# EAGLE design NSL_CylonIII_backside (EAGLE 5.10)

## Sheet 1 of 3
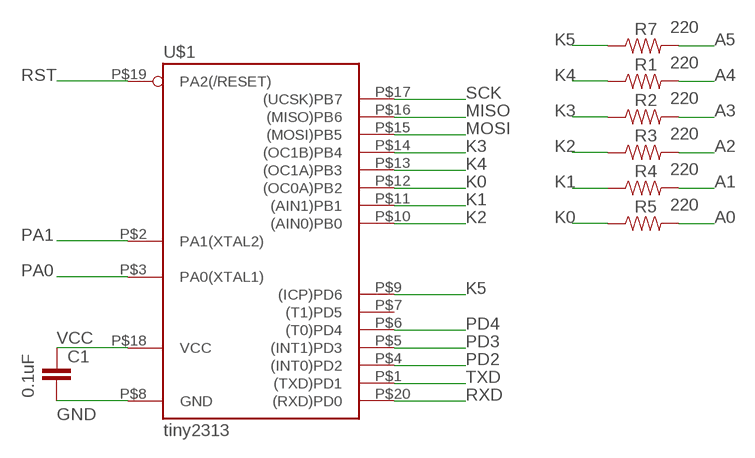
[diagram p0: schematic, sheet 1]

### Parts
C1  0.1uF  CAP0603-CAP  [0603-CAP]
R1  220  RESISTOR1206  [1206]
R2  220  RESISTOR1206  [1206]
R3  220  RESISTOR1206  [1206]
R4  220  RESISTOR1206  [1206]
R5  220  RESISTOR1206  [1206]
R7  220  RESISTOR1206  [1206]
U$1  tiny2313  TINY2313-*M*  [MLF20]

### Nets
A0 [LED]: R5.2 ; also sheet 3
A1: R4.2 ; also sheet 3
A2: R3.2 ; also sheet 3
A3: R2.2 ; also sheet 3
A4: R1.2 ; also sheet 3
A5: R7.2 ; also sheet 3
GND: C1.2 U$1.P$8(GND) ; also sheet 2
K0 [LED]: R5.1 U$1.P$12((OC0A)PB2)
K1 [LED]: R4.1 U$1.P$11((AIN1)PB1)
K2 [LED]: R3.1 U$1.P$10((AIN0)PB0)
K3 [LED]: R2.1 U$1.P$14((OC1B)PB4)
K4 [LED]: R1.1 U$1.P$13((OC1A)PB3)
K5: R7.1 U$1.P$9((ICP)PD6)
MISO: U$1.P$16((MISO)PB6) ; also sheet 2
MOSI: U$1.P$15((MOSI)PB5) ; also sheet 2
PA0: U$1.P$3(PA0(XTAL1))
PA1: U$1.P$2(PA1(XTAL2))
PD2: U$1.P$4((INT0)PD2)
PD3: U$1.P$5((INT1)PD3)
PD4: U$1.P$6((T0)PD4)
RST: U$1.P$19(PA2(/RESET)) ; also sheet 2
RXD: U$1.P$20((RXD)PD0)
SCK: U$1.P$17((UCSK)PB7) ; also sheet 2
TXD: U$1.P$1((TXD)PD1)
VCC: C1.1 U$1.P$18(VCC) ; also sheet 2
Unconnected: U$1.P$7((T1)PD5)

## Sheet 2 of 3
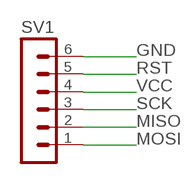
[diagram p1: schematic, sheet 2]

### Parts
SV1  MA06-1  [MA06-1]

### Nets
GND: SV1.6 ; also sheet 1
MISO: SV1.2 ; also sheet 1
MOSI: SV1.1 ; also sheet 1
RST: SV1.5 ; also sheet 1
SCK: SV1.3 ; also sheet 1
VCC: SV1.4 ; also sheet 1

## Sheet 3 of 3
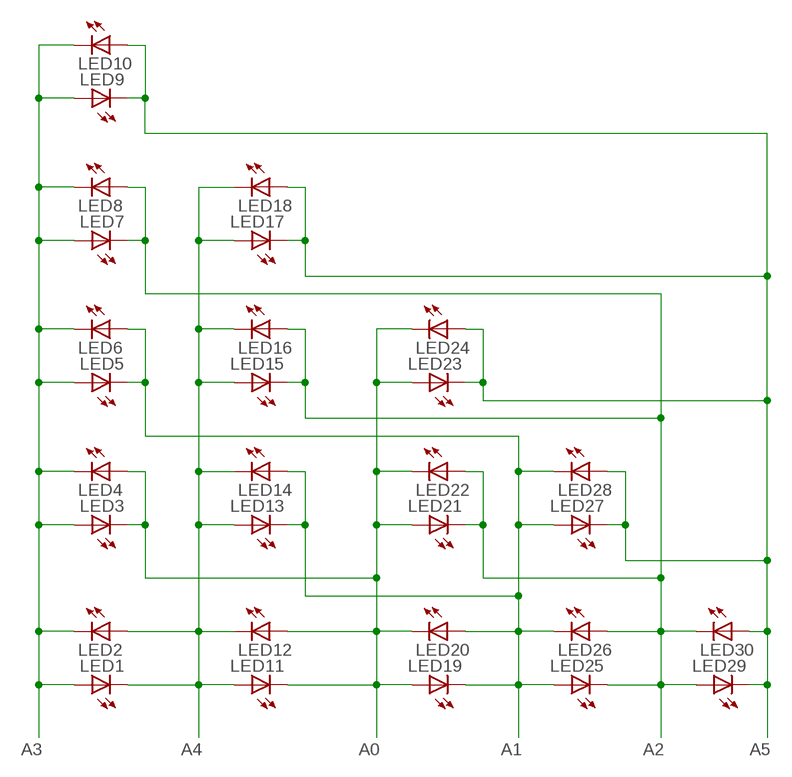
[diagram p2: schematic, sheet 3]

### Parts
LED1  LEDCHIPLED_1206  [CHIPLED_1206]
LED2  LEDCHIPLED_1206  [CHIPLED_1206]
LED3  LEDCHIPLED_1206  [CHIPLED_1206]
LED4  LEDCHIPLED_1206  [CHIPLED_1206]
LED5  LEDCHIPLED_1206  [CHIPLED_1206]
LED6  LEDCHIPLED_1206  [CHIPLED_1206]
LED7  LEDCHIPLED_1206  [CHIPLED_1206]
LED8  LEDCHIPLED_1206  [CHIPLED_1206]
LED9  LEDCHIPLED_1206  [CHIPLED_1206]
LED10  LEDCHIPLED_1206  [CHIPLED_1206]
LED11  LEDCHIPLED_1206  [CHIPLED_1206]
LED12  LEDCHIPLED_1206  [CHIPLED_1206]
LED13  LEDCHIPLED_1206  [CHIPLED_1206]
LED14  LEDCHIPLED_1206  [CHIPLED_1206]
LED15  LEDCHIPLED_1206  [CHIPLED_1206]
LED16  LEDCHIPLED_1206  [CHIPLED_1206]
LED17  LEDCHIPLED_1206  [CHIPLED_1206]
LED18  LEDCHIPLED_1206  [CHIPLED_1206]
LED19  LEDCHIPLED_1206  [CHIPLED_1206]
LED20  LEDCHIPLED_1206  [CHIPLED_1206]
LED21  LEDCHIPLED_1206  [CHIPLED_1206]
LED22  LEDCHIPLED_1206  [CHIPLED_1206]
LED23  LEDCHIPLED_1206  [CHIPLED_1206]
LED24  LEDCHIPLED_1206  [CHIPLED_1206]
LED25  LEDCHIPLED_1206  [CHIPLED_1206]
LED26  LEDCHIPLED_1206  [CHIPLED_1206]
LED27  LEDCHIPLED_1206  [CHIPLED_1206]
LED28  LEDCHIPLED_1206  [CHIPLED_1206]
LED29  LEDCHIPLED_1206  [CHIPLED_1206]
LED30  LEDCHIPLED_1206  [CHIPLED_1206]

### Nets
A0 [LED]: LED3.C LED4.A LED11.C LED12.A LED19.A LED20.C LED21.A LED22.C LED23.A LED24.C ; also sheet 1
A1: LED5.C LED6.A LED13.C LED14.A LED19.C LED20.A LED25.A LED26.C LED27.A LED28.C ; also sheet 1
A2: LED7.C LED8.A LED15.C LED16.A LED21.C LED22.A LED25.C LED26.A LED29.A LED30.C ; also sheet 1
A3: LED1.A LED2.C LED3.A LED4.C LED5.A LED6.C LED7.A LED8.C LED9.A LED10.C ; also sheet 1
A4: LED1.C LED2.A LED11.A LED12.C LED13.A LED14.C LED15.A LED16.C LED17.A LED18.C ; also sheet 1
A5: LED9.C LED10.A LED17.C LED18.A LED23.C LED24.A LED27.C LED28.A LED29.C LED30.A ; also sheet 1

## Library data of the parts
C1 = SparkFun:CAP: Capacitor Standard 0603 ceramic capacitor, and 0.1" leaded capacitor.
LED1-LED30 = led:LED: LED OSRAM: - CHIPLED LG R971, LG N971, LY N971, LG Q971, LY Q971, LO R971, LY R971 LH N974, LH R974 LS Q976, LO Q976, LY Q976 LO Q996 - Hyper CHIPLED LW Q18S LB Q993, LB Q99A, LB R99A - SideLED LS A670, LO A670, LY A670, LG A670, LP A670 LB A673, LV A673, LT A673, LW A673 LH A674 LY A675 LS A676, LA A676, LO A676, LY A676, LW A676 LS A679, LY A679, LG A679 - Hyper Micro SIDELED® LS Y876, LA Y876, LO Y876, LY Y876 LT Y87S - SmartLED LW L88C, LW L88S LB L89C, LB L89S, LG L890 LS L89K, LO L89K, LY L89K LS L896, LA L896, LO L896, LY L896 - TOPLED LS T670, LO T670, LY T670, LG T670, LP T670 LSG T670, LSP T670, LSY T670, LOP T670, LYG T670 LG T671, LOG T671, LSG T671 LB T673, LV T673, LT T673, LW T673 LH T674 LS T676, LA T676, LO T676, LY T676, LB T676, LH T676, LSB T676, LW T676 LB T67C, LV T67C, LT T67C, LS T67K, LO T67K, LY T67K, LW E67C LS E67B, LA E67B, LO E67B, LY E67B, LB E67C, LV E67C, LT E67C LW T67C LS T679, LY T679, LG T679 LS T770, LO T770, LY T770, LG T770, LP T770 LB T773, LV T773, LT T773, LW T773 LH T774 LS E675, LA E675, LY E675, LS T675 LS T776, LA T776, LO T776, LY T776, LB T776 LHGB T686 LT T68C, LB T68C - Hyper Mini TOPLED® LB M676 - Mini TOPLED Santana® LG M470 LS M47K, LO M47K, LY M47K Source: http://www.osram.convergy.de LUXEON: - LUMILED® LXK2-PW12-R00, LXK2-PW12-S00, LXK2-PW14-U00, LXK2-PW14-V00 LXK2-PM12-R00, LXK2-PM12-S00, LXK2-PM14-U00 LXK2-PE12-Q00, LXK2-PE12-R00, LXK2-PE12-S00, LXK2-PE14-T00, LXK2-PE14-U00 LXK2-PB12-K00, LXK2-PB12-L00, LXK2-PB12-M00, LXK2-PB14-N00, LXK2-PB14-P00, LXK2-PB14-Q00 LXK2-PR12-L00, LXK2-PR12-M00, LXK2-PR14-Q00, LXK2-PR14-R00 LXK2-PD12-Q00, LXK2-PD12-R00, LXK2-PD12-S00 LXK2-PH12-R00, LXK2-PH12-S00 LXK2-PL12-P00, LXK2-PL12-Q00, LXK2-PL12-R00 Source: www.luxeon.com KINGBRIGHT: KA-3528ASYC Source: www.kingbright.com
R1-R5 R7 = NSL:RESISTOR: Resistor Basic schematic elements and footprints for 0603, 1206, and PTH 1/10th watt (small) resistors.
SV1 = NSL:MA06-1: PIN HEADER
U$1 = NSL_Cylon:TINY2313*: Atmel Tiny2313 2K Flash, 128 bytes EEPROM, 128 bytes RAM

## Net classes
0 default: width 0.254 mm
1 LED: width 0.203 mm

## Board
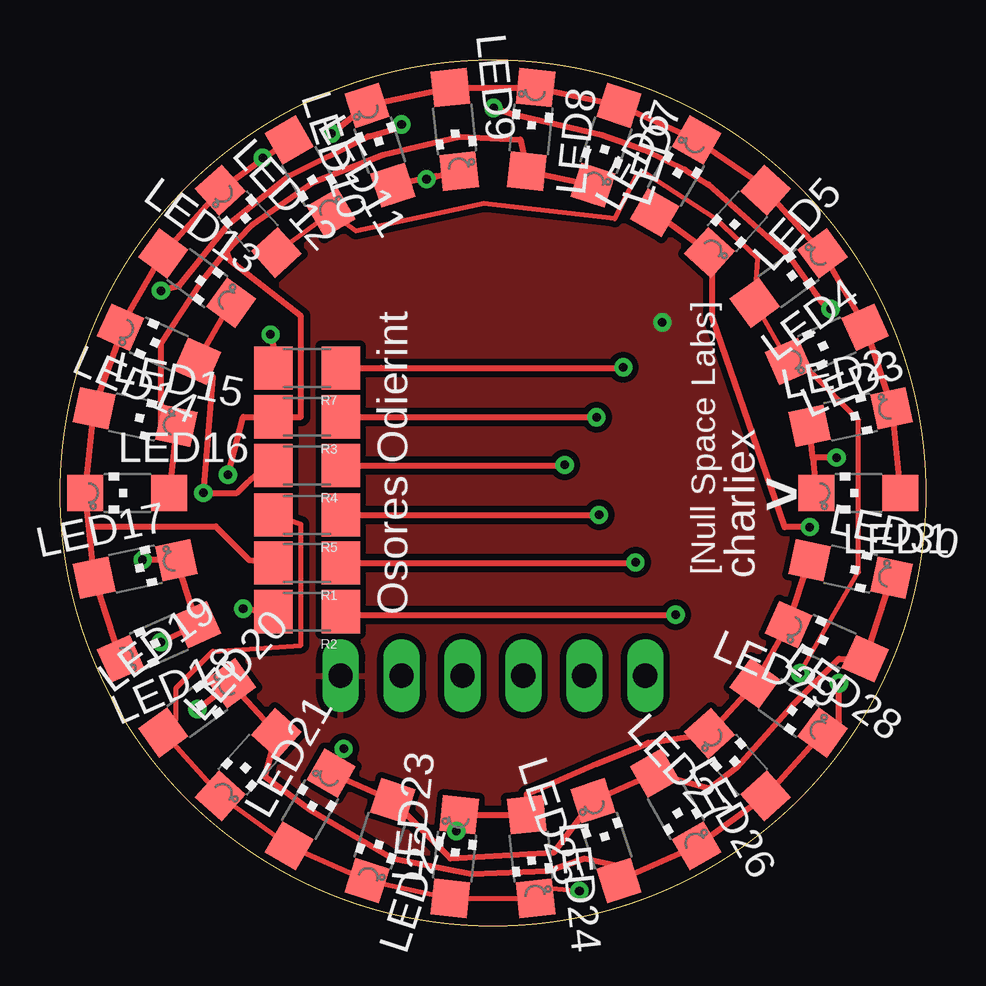
[diagram p3: board, top side]
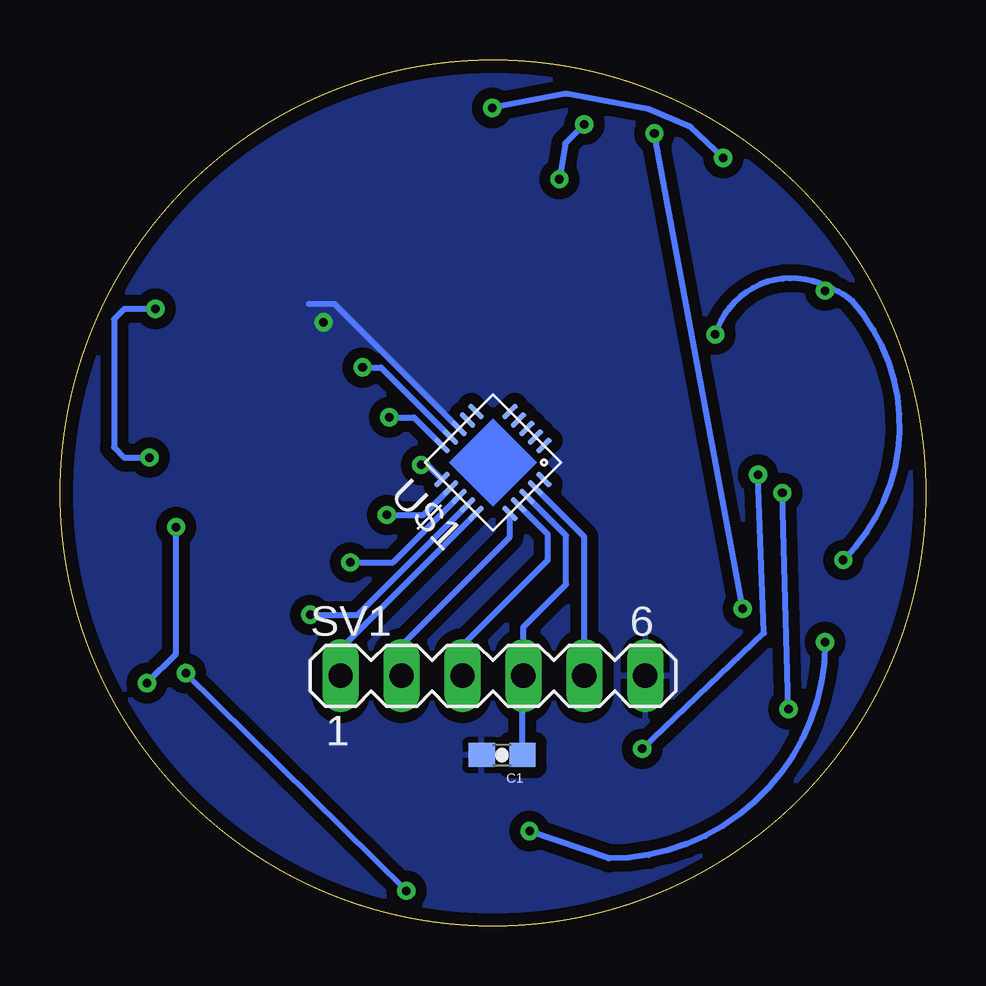
[diagram p4: board, bottom side, seen from below]

Size 36.1 x 36.1 mm. Coordinates in mm from the lower left corner, seen from the top.
Outline: circle at 18.05,18.05 radius 18.05
Copper layers (1*16): Top 0.0356mm / dielectric 1.5011mm / Bottom 0.0356mm
Design rules "SilverCircuits": minimum track width 7mil, minimum drill 14mil, track to track 7mil, track to pad 7mil, pad to pad 7mil, via to via 7mil, smd to smd 0mil, copper to edge 20mil, drill to drill 8mil, minimum pad ring 10mil, minimum via ring 8mil, stop-mask expansion 4mil, vias tented up to drill 0mil, thermal gap 10mil

### Footprints (pad centres in the part's own frame; a part is rotated, then mirrored left to right if it is on the bottom)
0603-CAP = smd 1.1 x 1: 1 -0.85,0; 2 0.85,0
CHIPLED_1206 = smd 1.5 x 1.5: A 0,-1.75; C 0,1.75
1206 = smd 1.6 x 1.8: 1 -1.4,0; 2 1.4,0
MA06-1 = drill 1.016 long: 1 -6.35,0; 2 -3.81,0; 3 -1.27,0; 4 1.27,0; 5 3.81,0; 6 6.35,0
MLF20 = smd 0.8 x 0.23: P$1 -2,1; P$2 -2,0.5; P$3 -2,0; P$4 -2,-0.5; P$5 -2,-1; P$11 2,-1; P$12 2,-0.5; P$13 2,0; P$14 2,0.5; P$15 2,1 | smd 0.23 x 0.8: P$6 -1,-2; P$7 -0.5,-2; P$8 0,-2; P$9 0.5,-2; P$10 1,-2; P$16 1,2; P$17 0.5,2; P$18 0,2; P$19 -0.5,2; P$20 -1,2

### Placement (x,y rotation side)
C1  17.67,7.13 180 bottom
LED1  33.29,18.05 90 top
LED2  32.96,21.22 282 top
LED3  31.97,24.25 114 top
LED4  30.38,27.01 306 top
LED5  28.25,29.38 138 top
LED6  25.67,31.25 330 top
LED7  22.76,32.54 162 top
LED8  19.64,33.21 354 top
LED9  16.46,33.21 186 top
LED10  13.34,32.54 18 top
LED11  10.43,31.25 210 top
LED12  7.85,29.38 42 top
LED13  5.72,27.01 234 top
LED14  4.13,24.25 66 top
LED15  3.14,21.22 258 top
LED16  2.81,18.05 90 top
LED17  3.14,14.88 282 top
LED18  4.13,11.85 114 top
LED19  5.72,9.09 306 top
LED20  7.85,6.72 138 top
LED21  10.43,4.85 330 top
LED22  13.34,3.56 162 top
LED23  16.46,2.89 354 top
LED24  19.64,2.89 186 top
LED25  22.76,3.56 18 top
LED26  25.67,4.85 210 top
LED27  28.25,6.72 42 top
LED28  30.38,9.09 234 top
LED29  31.97,11.85 66 top
LED30  32.96,14.88 258 top
R1  10.3,15.13 180 top
R2  10.3,13.1 180 top
R3  10.3,21.23 180 top
R4  10.3,19.19 180 top
R5  10.3,17.13 180 top
R7  10.3,23.26 180 top
SV1  18.05,10.43 0 bottom
U$1  18.05,19.32 225 bottom

### Tracks (layer width: path | path; a pad name or v marks a point on that pad's centre or on a via)
A0  (via drill 0.36)
  Top 0.203: LED12.A LED11.C 12.33,28.97 17.67,30.11 23.13,29.48 24.02,31.26 24.4,31.39 27.32,29.48 29.1,27.83 LED4.A LED3.C 30.44,23.13 31.26,23.13 33.29,21.1 33.29,14.75 v30.85,10.53 | R5.2 10.05,16.75 10.05,11.7 6.37,11.45 4.84,9.92 4.84,8.6 LED19.A LED20.C LED21.A LED22.C LED23.A LED24.C 19.88,1.18 20.28,1.59 v21.66,1.46
  Bottom 0.203: v21.66,1.46 v30.85,10.53
A1  (via drill 0.36)
  Top 0.254: LED13.C LED14.A 6.38,22.89 v5.98,18.05 7.38,18.05 7.76,18.43 arc-22 R4.2 9.16,19.57 | LED6.A LED5.C 27.19,28.01 27.19,25.37 30.22,16.63 v31.26,16.63 | 8.94,8.13 LED19.C v5.73,9.03 | 8.94,8.13 9.16,7.89 | v32.48,10.12 32.48,8.5 32.07,8.09 LED28.C LED27.A LED26.C LED25.A 23.3,2.51 21.86,2.81 20.34,2.3 17.16,2.18 13.86,2.81 10.43,4.84 8.52,6.24 LED20.A 8.91,8.09 8.94,8.13
  Bottom 0.254: v5.73,9.03 v5.98,18.05 | v31.26,16.63 31.26,11.34 v32.48,10.12
A2  (via drill 0.36)
  Top 0.254: LED30.C LED29.A 32.48,11.14 30.5,9.16 28.21,6.62 27.07,5.73 LED26.A LED25.C 20.59,3.06 16.27,2.81 14.24,4.86 arc90 LED22.A LED21.C v11.83,7.38 | LED16.A LED15.C 4.21,20.85 4.21,24.27 5.86,26.81 6.84,28.04 | LED7.C LED8.A 19.19,32.78 16.65,32.91 13.48,32.15 10.56,31 8.02,29.23 6.84,28.04 | v7,18.81 7.64,21.23 R3.2 10.05,21.23 10.05,25.42 7.1,27.74 6.97,28.04 6.84,28.04
  Bottom 0.254: v11.83,7.38 6.75,12.21 v7,18.81
A3  (via drill 0.36)
  Top 0.254: 29.26,30.9 LED6.C LED7.A LED8.C LED9.A LED10.C v11.32,33.04 | 29.26,30.9 29.48,30.75 | LED1.A LED2.C LED3.A LED4.C LED5.A 29.23,30.85 29.26,30.9 | v7.64,13.22 R2.2
  Bottom 0.254: v7.64,13.22 v11.32,33.04
A4  (via drill 0.36)
  Top 0.254: 8.48,31.98 LED12.C LED13.A LED14.C 2.81,25.16 2.75,25.18 | 8.48,31.98 LED11.A | 31.39,19.51 LED1.C | 31.39,19.51 LED2.A | LED18.C LED17.A 1.2,16.74 | 1.2,16.74 LED16.C LED15.A 2.75,25.18 | 2.75,25.18 2.91,25.61 | R1.2 7.89,15.26 6.49,16.65 1.29,16.65 1.2,16.74 | v32.38,19.52 31.51,19.52 31.39,19.51 | v32.12,25.72 31.74,26.03 31.41,26.48 30.39,27.93 27.04,30.9 26.05,31.54 24.35,32.35 22.57,32.98 19.09,33.8 19.02,33.8 v18.07,34.1 | 8.48,31.98 v8.45,32.02
  Bottom 0.254: v32.38,19.52 33.42,19.52 33.85,19.95 33.85,25.29 33.42,25.72 v32.12,25.72 | 8.5,31.97 v8.45,32.02 9.79,33.29 11.57,34.05 15,34.69 v18.07,34.1
A5  (via drill 0.36)
  Top 0.254: LED30.A LED29.C LED28.A LED27.C 24.53,7.64 22.37,6.75 19.46,5.49 LED24.A LED23.C 16.64,4.58 arc-90 v16.53,3.95 | 15.69,31.26 LED10.A | 15.69,31.26 LED9.C | v3.44,15.26 3.45,15.25 LED17.C LED18.A v4.21,11.83 | v8.78,24.65 arc-23 R7.2 | v15.28,31.13 15.41,31.13 15.69,31.26 | 4.44,26.48 v4.21,26.48 4.97,26.69 7,29.23 9.54,31.26 12.84,32.91 14.24,33.29 v14.24,33.42
  Bottom 0.254: v3.44,15.26 arc-87 3.06,26.05 arc-20 4.12,26.64 | 4.12,26.64 arc-101 v8.78,24.65 | v4.21,11.83 arc90 13.22,2.81 v16.53,3.95 | v15.28,31.13 15.03,32.63 v14.24,33.42 | v4.21,26.48 4.18,26.51 4.12,26.64
GND  (via drill 0.36)
  Bottom 0.254: U$1.P$8 | U$1.P$8 20.08,21.35 24.65,25.92 25.72,25.92
  other vias: 25.11,25.16
  pour Top (isolate 0.254): 35.83,18.79 arc90 18.79,35.83 17.36,35.83 arc90 0.27,18.74 0.27,17.31 arc90 17.31,0.27 18.56,0.27 arc90 35.83,17.54
  pour Bottom (isolate 0.457): 35.83,18.79 arc90 18.79,35.83 17.36,35.83 arc90 0.27,18.74 0.27,17.31 arc90 17.31,0.27 18.56,0.27 arc90 35.83,17.54
K0  (via drill 0.36)
  Top 0.254: v22.47,17.14 22.46,17.13 R5.1
  Bottom 0.254: U$1.P$12 20.94,17.14 v22.47,17.14
K1  (via drill 0.36)
  Top 0.254: v21.05,19.22 21.02,19.19 R4.1
  Bottom 0.254: U$1.P$11 20.78,19.22 v21.05,19.22
K2  (via drill 0.36)
  Top 0.254: v22.37,21.2 22.34,21.23 R3.1
  Bottom 0.254: U$1.P$10 21.34,21.2 v22.37,21.2
K3  (via drill 0.36)
  Top 0.254: R2.1 11.83,12.97 v25.67,12.97
  Bottom 0.254: v25.67,12.97 23.69,12.97 U$1.P$14
K4  (via drill 0.36)
  Top 0.254: v23.99,15.15 23.97,15.13 R1.1
  Bottom 0.254: U$1.P$13 22.22,15.15 v23.99,15.15
K5  (via drill 0.36)
  Top 0.254: 13.41,23.26 R7.1 23.46,23.26 v23.49,23.28
  Bottom 0.254: U$1.P$9 22.72,23.28 v23.49,23.28
MISO
  Bottom 0.254: SV1.2 21.86,11.7 17.34,16.22 U$1.P$16
MOSI
  Bottom 0.254: U$1.P$15 24.4,11.56 SV1.1
RST
  Bottom 0.254: SV1.5 14.24,16.22 U$1.P$19
SCK
  Bottom 0.254: U$1.P$17 15.76,16.33 15.76,15.26 19.32,11.7 SV1.3
VCC
  Bottom 0.254: U$1.P$18 16.27,17.54 15,16.27 15,14.24 16.78,12.46 SV1.4 16.82,10.39 C1.1

### Text on the board
tPlace: [Null Space Labs] | > | charliex | Osores Odierint